# Altium schematic sheet Urukul_FPGA_LVDS.SchDoc: =DocumentName
size A3; DocumentNumber: 1; Revision: 0; SheetNumber: 15; SheetTotal: 17; Last modified by: Krzysztof Belewicz
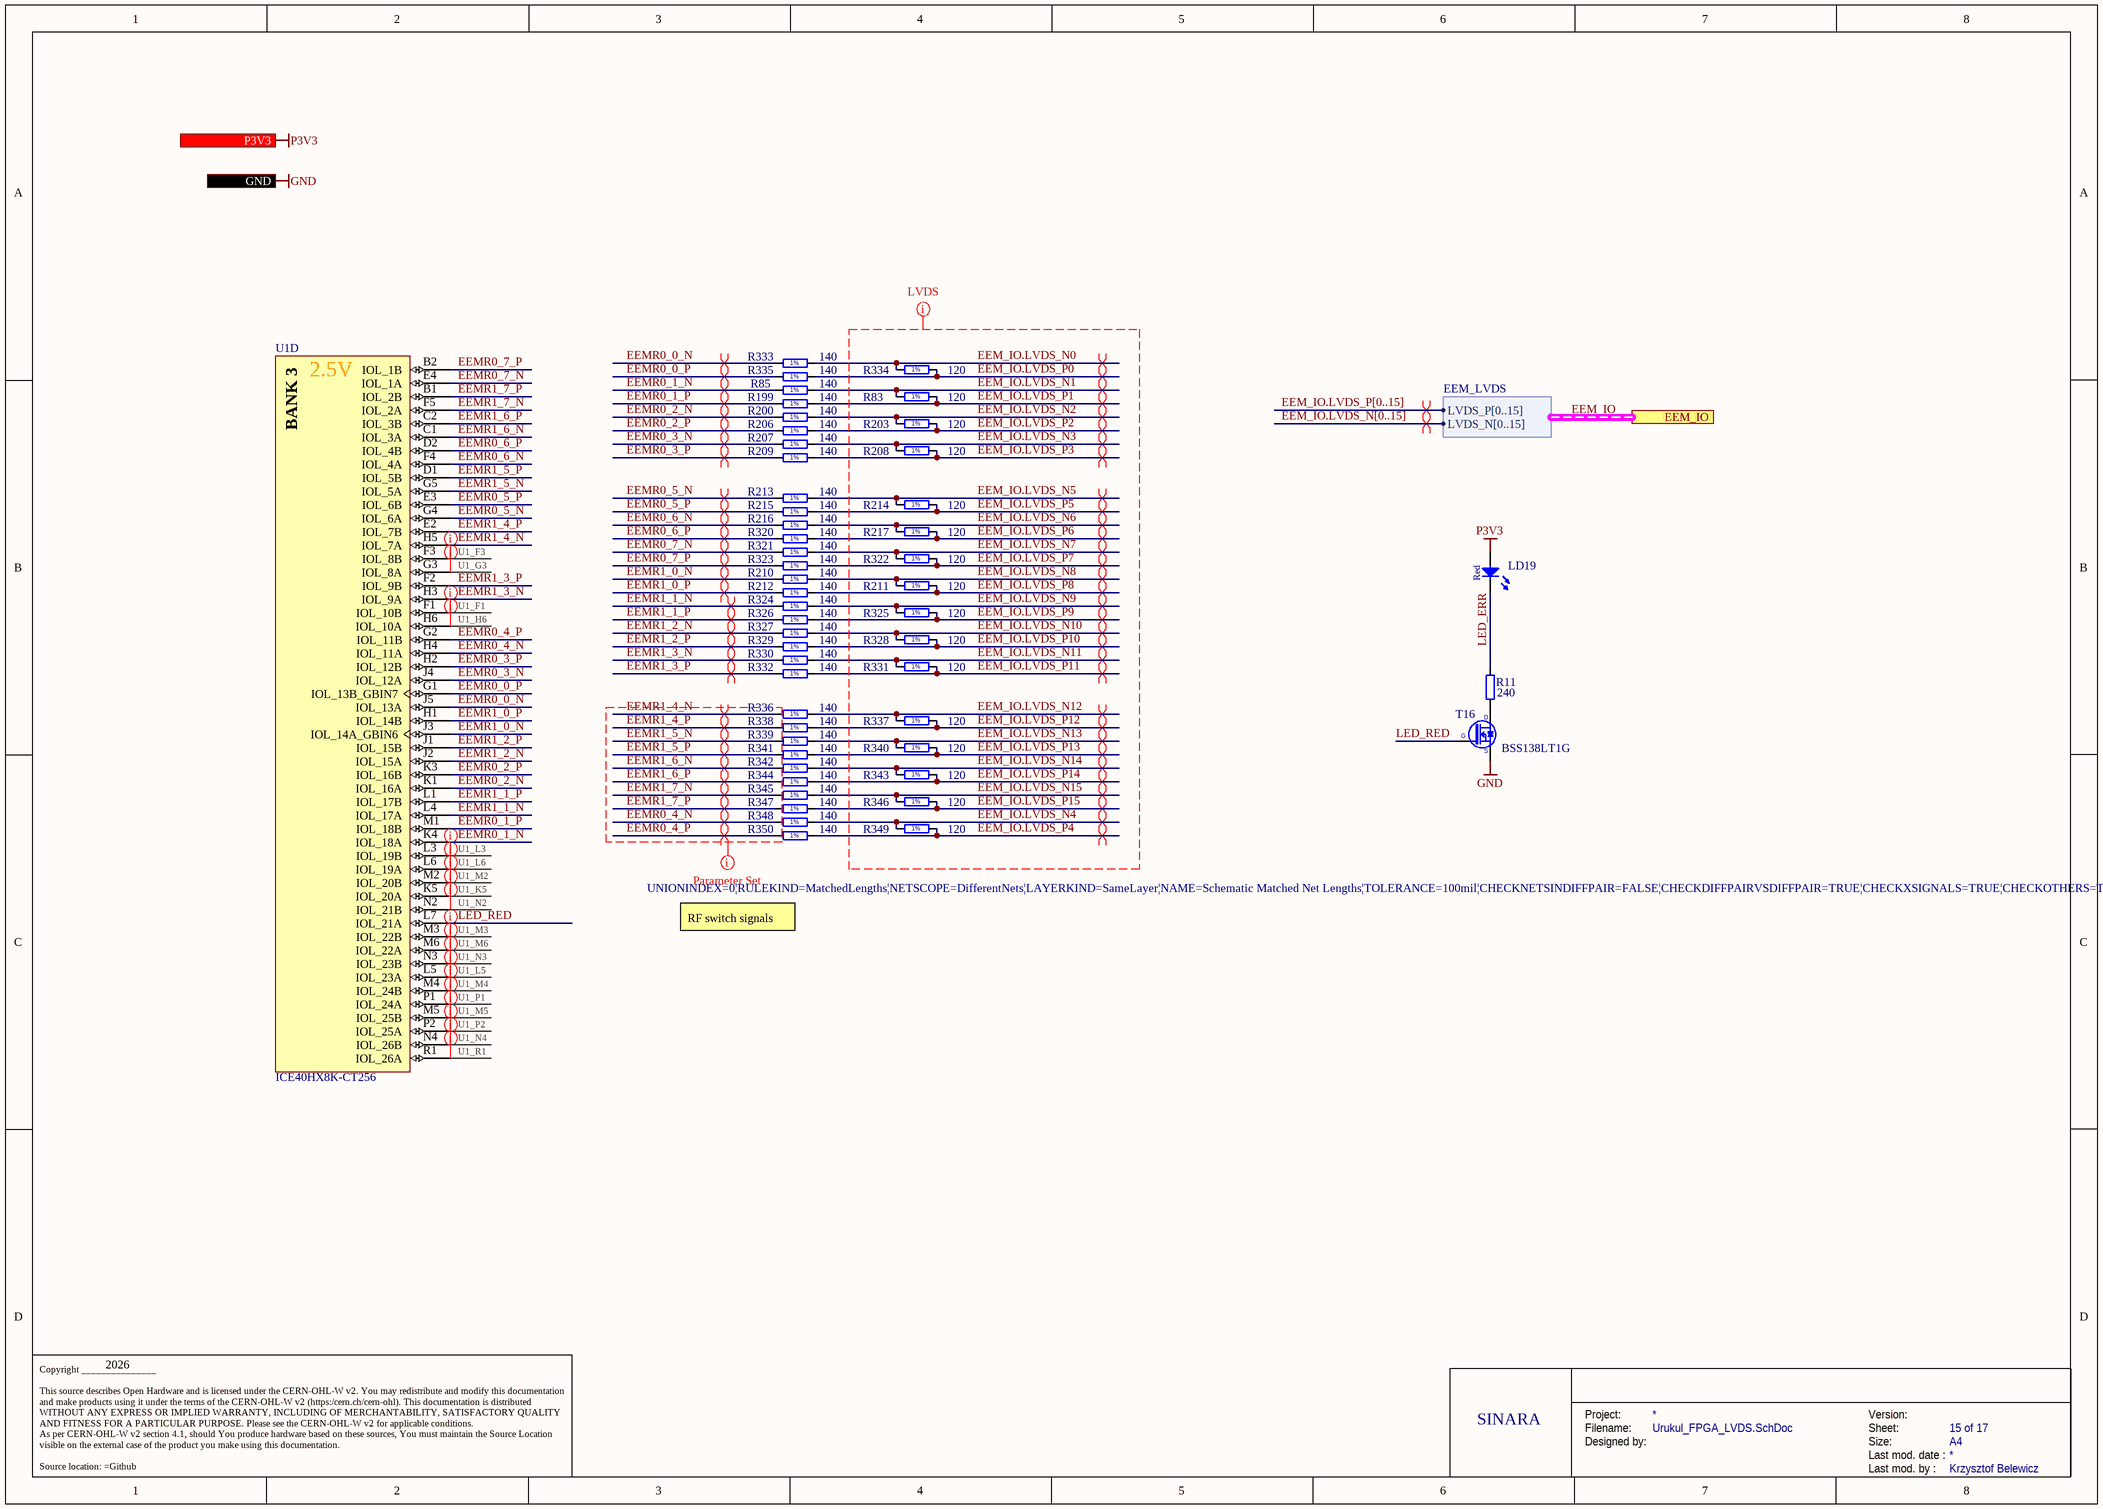
[diagram p0: Urukul_FPGA_LVDS.SchDoc]

## Parts
LD19  Red  [LED_AVAGO_HSMC-C120]
R11  240  [RESC1005X40N]
R83  120  [RESC1005X40N]
R85  140  [RESC0603X28N]
R199  140  [RESC0603X28N]
R200  140  [RESC0603X28N]
R203  120  [RESC1005X40N]
R206  140  [RESC0603X28N]
R207  140  [RESC0603X28N]
R208  120  [RESC1005X40N]
R209  140  [RESC0603X28N]
R210  140  [RESC0603X28N]
R211  120  [RESC1005X40N]
R212  140  [RESC0603X28N]
R213  140  [RESC0603X28N]
R214  120  [RESC1005X40N]
R215  140  [RESC0603X28N]
R216  140  [RESC0603X28N]
R217  120  [RESC1005X40N]
R320  140  [RESC0603X28N]
R321  140  [RESC0603X28N]
R322  120  [RESC1005X40N]
R323  140  [RESC0603X28N]
R324  140  [RESC0603X28N]
R325  120  [RESC1005X40N]
R326  140  [RESC0603X28N]
R327  140  [RESC0603X28N]
R328  120  [RESC1005X40N]
R329  140  [RESC0603X28N]
R330  140  [RESC0603X28N]
R331  120  [RESC1005X40N]
R332  140  [RESC0603X28N]
R333  140  [RESC0603X28N]
R334  120  [RESC1005X40N]
R335  140  [RESC0603X28N]
R336  140  [RESC0603X28N]
R337  120  [RESC1005X40N]
R338  140  [RESC0603X28N]
R339  140  [RESC0603X28N]
R340  120  [RESC1005X40N]
R341  140  [RESC0603X28N]
R342  140  [RESC0603X28N]
R343  120  [RESC1005X40N]
R344  140  [RESC0603X28N]
R345  140  [RESC0603X28N]
R346  120  [RESC1005X40N]
R347  140  [RESC0603X28N]
R348  140  [RESC0603X28N]
R349  120  [RESC1005X40N]
R350  140  [RESC0603X28N]
T16  BSS138LT1G  [SOT95P240X110-3N]
U1  ICE40HX8K-CT256  [LATC-caBGA-256]  (part D of 5)

## Ports
EEM_IO (harness EEM_LVDS), GND, P3V3 (in)

## Harnesses
EEM_LVDS: LVDS_P[0..15], LVDS_N[0..15]

## Nets
GND: T16.2(S) ; port GND
P3V3: LD19.2(A) ; port P3V3
EEM_IO.LVDS_N0: R333.2 R334.1
EEM_IO.LVDS_N1: R83.1 R85.2
EEM_IO.LVDS_N2: R200.2 R203.1
EEM_IO.LVDS_N3: R207.2 R208.1
EEM_IO.LVDS_N4: R348.2 R349.1
EEM_IO.LVDS_N5: R213.2 R214.1
EEM_IO.LVDS_N6: R216.2 R217.1
EEM_IO.LVDS_N7: R321.2 R322.1
EEM_IO.LVDS_N8: R210.2 R211.1
EEM_IO.LVDS_N9: R324.2 R325.1
EEM_IO.LVDS_N10: R327.2 R328.1
EEM_IO.LVDS_N11: R330.2 R331.1
EEM_IO.LVDS_N12: R336.2 R337.1
EEM_IO.LVDS_N13: R339.2 R340.1
EEM_IO.LVDS_N14: R342.2 R343.1
EEM_IO.LVDS_N15: R345.2 R346.1
EEM_IO.LVDS_P0: R334.2 R335.2
EEM_IO.LVDS_P1: R83.2 R199.2
EEM_IO.LVDS_P2: R203.2 R206.2
EEM_IO.LVDS_P3: R208.2 R209.2
EEM_IO.LVDS_P4: R349.2 R350.2
EEM_IO.LVDS_P5: R214.2 R215.2
EEM_IO.LVDS_P6: R217.2 R320.2
EEM_IO.LVDS_P7: R322.2 R323.2
EEM_IO.LVDS_P8: R211.2 R212.2
EEM_IO.LVDS_P9: R325.2 R326.2
EEM_IO.LVDS_P10: R328.2 R329.2
EEM_IO.LVDS_P11: R331.2 R332.2
EEM_IO.LVDS_P12: R337.2 R338.2
EEM_IO.LVDS_P13: R340.2 R341.2
EEM_IO.LVDS_P14: R343.2 R344.2
EEM_IO.LVDS_P15: R346.2 R347.2
EEMR0_0_N: R333.1 U1.J5(IOL_13A)
EEMR0_0_P: R335.1 U1.G1(IOL_13B_GBIN7)
EEMR0_1_N: R85.1 U1.K4(IOL_18A)
EEMR0_1_P: R199.1 U1.M1(IOL_18B)
EEMR0_2_N: R200.1 U1.K1(IOL_16A)
EEMR0_2_P: R206.1 U1.K3(IOL_16B)
EEMR0_3_N: R207.1 U1.J4(IOL_12A)
EEMR0_3_P: R209.1 U1.H2(IOL_12B)
EEMR0_4_N: R348.1 U1.H4(IOL_11A)
EEMR0_4_P: R350.1 U1.G2(IOL_11B)
EEMR0_5_N: R213.1 U1.G4(IOL_6A)
EEMR0_5_P: R215.1 U1.E3(IOL_6B)
EEMR0_6_N: R216.1 U1.F4(IOL_4A)
EEMR0_6_P: R320.1 U1.D2(IOL_4B)
EEMR0_7_N: R321.1 U1.E4(IOL_1A)
EEMR0_7_P: R323.1 U1.B2(IOL_1B)
EEMR1_0_N: R210.1 U1.J3(IOL_14A_GBIN6)
EEMR1_0_P: R212.1 U1.H1(IOL_14B)
EEMR1_1_N: R324.1 U1.L4(IOL_17A)
EEMR1_1_P: R326.1 U1.L1(IOL_17B)
EEMR1_2_N: R327.1 U1.J2(IOL_15A)
EEMR1_2_P: R329.1 U1.J1(IOL_15B)
EEMR1_3_N: R330.1 U1.H3(IOL_9A)
EEMR1_3_P: R332.1 U1.F2(IOL_9B)
EEMR1_4_N: R336.1 U1.H5(IOL_7A)
EEMR1_4_P: R338.1 U1.E2(IOL_7B)
EEMR1_5_N: R339.1 U1.G5(IOL_5A)
EEMR1_5_P: R341.1 U1.D1(IOL_5B)
EEMR1_6_N: R342.1 U1.C1(IOL_3A)
EEMR1_6_P: R344.1 U1.C2(IOL_3B)
EEMR1_7_N: R345.1 U1.F5(IOL_2A)
EEMR1_7_P: R347.1 U1.B1(IOL_2B)
LED_ERR: LD19.1(C) R11.1
LED_RED: T16.1(G) U1.L7(IOL_21A)
U1_F1: U1.F1(IOL_10B)
U1_F3: U1.F3(IOL_8B)
U1_G3: U1.G3(IOL_8A)
U1_H6: U1.H6(IOL_10A)
U1_K5: U1.K5(IOL_20A)
U1_L3: U1.L3(IOL_19B)
U1_L5: U1.L5(IOL_23A)
U1_L6: U1.L6(IOL_19A)
U1_M2: U1.M2(IOL_20B)
U1_M3: U1.M3(IOL_22B)
U1_M4: U1.M4(IOL_24B)
U1_M5: U1.M5(IOL_25B)
U1_M6: U1.M6(IOL_22A)
U1_N2: U1.N2(IOL_21B)
U1_N3: U1.N3(IOL_23B)
U1_N4: U1.N4(IOL_26B)
U1_P1: U1.P1(IOL_24A)
U1_P2: U1.P2(IOL_25A)
U1_R1: U1.R1(IOL_26A)
NetR11_2: R11.2 T16.3(D)

## Buses and harness runs
bus EEM_IO.LVDS_N[0..15]
bus EEM_IO.LVDS_P[0..15]
harness EEM_IO = port EEM_IO

## Layout directives
differential pair: EEM_IO.LVDS_N0, EEM_IO.LVDS_N1, EEM_IO.LVDS_N2, EEM_IO.LVDS_N3, EEM_IO.LVDS_N4, EEM_IO.LVDS_N5, EEM_IO.LVDS_N6, EEM_IO.LVDS_N7, EEM_IO.LVDS_N8, EEM_IO.LVDS_N9, EEM_IO.LVDS_N10, EEM_IO.LVDS_N11, EEM_IO.LVDS_N12, EEM_IO.LVDS_N13, EEM_IO.LVDS_N14, EEM_IO.LVDS_N15, EEM_IO.LVDS_P0, EEM_IO.LVDS_P1, EEM_IO.LVDS_P2, EEM_IO.LVDS_P3, EEM_IO.LVDS_P4, EEM_IO.LVDS_P5, EEM_IO.LVDS_P6, EEM_IO.LVDS_P7, EEM_IO.LVDS_P8, EEM_IO.LVDS_P9, EEM_IO.LVDS_P10, EEM_IO.LVDS_P11, EEM_IO.LVDS_P12, EEM_IO.LVDS_P13, EEM_IO.LVDS_P14, EEM_IO.LVDS_P15, EEMR0_0_N, EEMR0_0_P, EEMR0_1_N, EEMR0_1_P, EEMR0_2_N, EEMR0_2_P, EEMR0_3_N, EEMR0_3_P, EEMR0_4_N, EEMR0_4_P, EEMR0_5_N, EEMR0_5_P, EEMR0_6_N, EEMR0_6_P, EEMR0_7_N, EEMR0_7_P, EEMR1_0_N, EEMR1_0_P, EEMR1_1_N, EEMR1_1_P, EEMR1_2_N, EEMR1_2_P, EEMR1_3_N, EEMR1_3_P, EEMR1_4_N, EEMR1_4_P, EEMR1_5_N, EEMR1_5_P, EEMR1_6_N, EEMR1_6_P, EEMR1_7_N, EEMR1_7_P
net class LVDS: EEM_IO.LVDS_N0, EEM_IO.LVDS_N1, EEM_IO.LVDS_N2, EEM_IO.LVDS_N3, EEM_IO.LVDS_N4, EEM_IO.LVDS_N5, EEM_IO.LVDS_N6, EEM_IO.LVDS_N7, EEM_IO.LVDS_N8, EEM_IO.LVDS_N9, EEM_IO.LVDS_N10, EEM_IO.LVDS_N11, EEM_IO.LVDS_N12, EEM_IO.LVDS_N13, EEM_IO.LVDS_N14, EEM_IO.LVDS_N15, EEM_IO.LVDS_P0, EEM_IO.LVDS_P1, EEM_IO.LVDS_P2, EEM_IO.LVDS_P3, EEM_IO.LVDS_P4, EEM_IO.LVDS_P5, EEM_IO.LVDS_P6, EEM_IO.LVDS_P7, EEM_IO.LVDS_P8, EEM_IO.LVDS_P9, EEM_IO.LVDS_P10, EEM_IO.LVDS_P11, EEM_IO.LVDS_P12, EEM_IO.LVDS_P13, EEM_IO.LVDS_P14, EEM_IO.LVDS_P15
rule Matched Net Lengths [Tolerance = 2.54mm]; net class RFSW_CPLD: EEMR0_4_N, EEMR0_4_P, EEMR1_4_N, EEMR1_4_P, EEMR1_5_N, EEMR1_5_P, EEMR1_6_N, EEMR1_6_P, EEMR1_7_N, EEMR1_7_P
net class Unused: U1_F1, U1_F3, U1_G3, U1_H6, U1_K5, U1_L3, U1_L5, U1_L6, U1_M2, U1_M3, U1_M4, U1_M5, U1_M6, U1_N2, U1_N3, U1_N4, U1_P1, U1_P2, U1_R1
differential pair; differential pair class Diff_100Ohm: (no net found under the mark)

## Notes on the sheet
- 2.5V
- RF switch signals
- 2026
- SINARA
- Project:
- Designed by:
- Filename:
- Size:
- Version:
- Last mod. date :
- Sheet:
- A4
- Copyright _______________
  This source describes Open Hardware and is licensed under the CERN-OHL-W v2. You may redistribute and modify this documentation and make products using it under the terms of the CERN-OHL-W v2 (https:/cern.ch/cern-ohl). This documentation is distributed WITHOUT ANY EXPRESS OR IMPLIED WARRANTY, INCLUDING OF MERCHANTABILITY, SATISFACTORY QUALITY AND FITNESS FOR A PARTICULAR PURPOSE. Please see the CERN-OHL-W v2 for applicable conditions.
  As per CERN-OHL-W v2 section 4.1, should You produce hardware based on these sources, You must maintain the Source Location visible on the external case of the product you make using this documentation.
  Source location: =Github
- Last mod. by :
- (in symbol CMP-0962-00001-1, part D) BANK 3
- (in symbol R0201_140R_1%_0.05W_200PPM) 1%
- (in symbol R0402_120R_1%_0.0625W_100PPM) 1%

## Library data of the parts
LD19 = LED_AVAGO_HSMC-C120: LED Red 1C 2A; Part Description: High Performance Right Angle Chip Red LED; Manufacturer: AVAGO TECHNOLOGIES; PressFit: No; Bonding: No; Part Number: LED_AVAGO_HSMC-C120; Component Kind: Standard; Component Type: Standard; Color: Red; PackageDescription: Red Chip LED, 2-Leads, Body 1.7x1.1mm, Side Emitting Package; Manufacturer Part Number: HSMC-C120; Pin Count: 2; Mounted: Yes; Socket: No; SMD: Yes; Sense: No; ComponentHeight: 0.7mm; HelpURL: \\cern.ch\dfs\Applications\Altium\Datasheets\LED_AVAGO_HSMC-C120.pdf; ComponentLink1URL: \\cern.ch\dfs\Applications\Altium\Datasheets\LED_AVAGO_HSMC-C120_DESIGN-GUIDE.pdf; ComponentLink1Description: Design Guide; Author: CERN DEM JMW; CreateDate: 22.07.2009; LatestRevisionDate: 20.06.2012
R11 = R0402_240R_1%_0.0625W_100PPM: Resistor - 1%; Part Description: General Purpose Thick Film Chip Resistor; Manufacturer: GENERIC; Manufacturer1 Part Number: 232270672401L; TC: ±100ppm/°C; PressFit: No; Part Number: R0402_240R_1%_0.0625W_100PPM; Component Kind: Standard; Component Type: Standard; Pin Count: 2; Value: 240; Status: Not Recommended; Power: 0.0625W; Tolerance: ±1%; Manufacturer Part Number: R0402_240R_1%_0.0625W_100PPM; Case: 0402; Mounted: Yes; Sense: No; Socket: No; SMD: Yes; Manufacturer1 Example: YAGEO PHYCOMP; Manufacturer1 ComponentHeight: 0.4mm; HelpURL: \\cern.ch\dfs\Applications\Altium\Datasheets\R0402_Phycomp_RC0402.pdf; Author: CERN DEM JLC; CreateDate: 03.12.2007; LatestRevisionDate: 17.10.2012
R83 R203 R208 R211 R214 R217 R322 R325 R328 R331 R334 R337 R340 R343 R346 R349 = R0402_120R_1%_0.0625W_100PPM: Resistor - 1%; Part Description: General Purpose Thick Film Chip Resistor; Manufacturer: GENERIC; Manufacturer1 Part Number: 232270671201L; TC: ±100ppm/°C; PressFit: No; Part Number: R0402_120R_1%_0.0625W_100PPM; Component Kind: Standard; Component Type: Standard; Pin Count: 2; Value: 120; Status: Not Recommended; Power: 0.0625W; Tolerance: ±1%; Manufacturer Part Number: R0402_120R_1%_0.0625W_100PPM; Case: 0402; Mounted: Yes; Sense: No; Socket: No; SMD: Yes; Manufacturer1 Example: YAGEO PHYCOMP; Manufacturer1 ComponentHeight: 0.4mm; HelpURL: \\cern.ch\dfs\Applications\Altium\Datasheets\R0402_Phycomp_RC0402.pdf; Author: CERN DEM JLC; CreateDate: 03.12.2007; LatestRevisionDate: 17.10.2012
R85 R199 R200 R206 R207 R209 R210 R212 R213 R215 R216 R320 R321 R323 R324 R326 R327 R329 R330 R332 R333 R335 R336 R338 R339 R341 R342 R344 R345 R347 R348 R350 = R0201_140R_1%_0.05W_200PPM: Resistor - 1%; Part Description: Thick Film Chip Resistor; Manufacturer: GENERIC; Manufacturer1 Part Number: CRCW0201140RFNED; Power: 0.05W; TC: ±200ppm/°C; PressFit: No; Part Number: R0201_140R_1%_0.05W_200PPM; Component Kind: Standard; Component Type: Standard; Pin Count: 2; Value: 140; Status: Not Recommended; Tolerance: ±1%; Manufacturer Part Number: R0201_140R_1%_0.05W_200PPM; Case: 0201; Mounted: Yes; Sense: No; Socket: No; SMD: Yes; Manufacturer1 Example: VISHAY; Manufacturer1 ComponentHeight: 0.27mm; HelpURL: \\cern.ch\dfs\Applications\Altium\Datasheets\R0201_VISHAY_CRCW e3.pdf; Author: CERN DEM MR; CreateDate: 26/01/2016; LatestRevisionDate: 26/01/2016
T16 = BSS138LT1G: N-CHANNEL MOSFET WITH DIODE; Part Description: 50V 200mA N-Channel Enhancement Mode Field-Effect Transistor; Manufacturer: ON SEMICONDUCTOR; PressFit: No; Bonding: No; Part Number: BSS138LT1G; Component Kind: Standard; Component Type: Standard; Device: BSS138LT1G; PackageDescription: SOT23 3-Leads, Pitch 0.95mm - Body 1.4x3mm, IPC Medium Density; Manufacturer Part Number: BSS138LT1G; Pin Count: 3; Case: SOT23-3; Mounted: Yes; Socket: No; SMD: Yes; Sense: No; ComponentHeight: 1.11mm; HelpURL: \\cern.ch\dfs\Applications\Altium\Datasheets\BSS138LT1G.pdf; Author: CERN DEM JLC; CreateDate: 23.03.2009; LatestRevisionDate: 23.03.2009
U1 = CMP-0962-00001-1: iCE40 HX8K Series FPGA Family, 7680 Logic Cells, 1.2 V Core, 128 K Embedded RAM Bits, 256-ball caBGA, Pb-Free, Tray; Manufacturer: Lattice Semiconductor; Supply Voltage: 1.2V; Phase-Locked Loops: 2; Logic Cells: 7680; Embedded RAM Bits: 128K; PackageReference: caBGA-256; PackageDescription: 256-Ball Chip Array Ball Grid Array, Body 14 x 14 mm, Pitch 0.8 mm; RoHS: TRUE; Packing: Tray; Mounting Technology: Surface Mount; ComponentLink3URL: http://www.latticesemi.com/lit/docs/package/pkg.pdf; ComponentLink1Description: Manufacturer URL; ComponentLink3Description: Package Specification; Code_JEDEC: MO-275; PackageVersion: Rev. 03.9, 02/2013; ComponentLink1URL: http://www.latticesemi.com/en; ComponentLink2URL: http://www.latticesemi.com/~/media/Documents/DataSheets/iCE/iCE40LPHXFamilyDataSheet.pdf; Manufacturer Part Number: ICE40HX8K-CT256; ComponentLink2Description: Datasheet; DatasheetVersion: Rev. 02.9; Part Number: ICE40HX8K-CT256